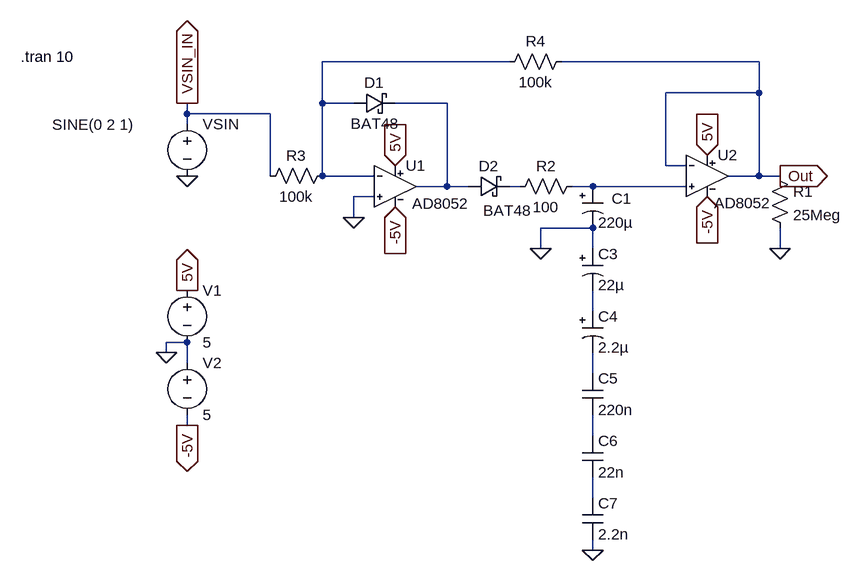
[diagram p0: schematic lf_wobbulator_tietze_schenks.asc]
lf_wobbulator_tietze_schenks.asc, the LTspice schematic file:
Version 4
SHEET 1 1728 920
WIRE 624 -32 336 -32
WIRE 1008 -32 704 -32
WIRE 1008 16 1008 -32
WIRE 1008 16 864 16
WIRE 336 32 336 -32
WIRE 384 32 336 32
WIRE 528 32 448 32
WIRE 128 48 128 32
WIRE 256 48 128 48
WIRE 128 64 128 48
WIRE 864 128 864 16
WIRE 896 128 864 128
WIRE 256 144 256 48
WIRE 336 144 336 32
WIRE 416 144 336 144
WIRE 1008 144 1008 16
WIRE 1008 144 960 144
WIRE 1040 144 1008 144
WIRE 528 160 528 32
WIRE 528 160 480 160
WIRE 560 160 528 160
WIRE 640 160 624 160
WIRE 752 160 720 160
WIRE 896 160 752 160
WIRE 416 176 384 176
WIRE 384 208 384 176
WIRE 752 224 672 224
WIRE 672 256 672 224
WIRE 752 256 752 224
WIRE 1040 256 1040 224
WIRE 752 352 752 320
WIRE 128 400 96 400
WIRE 96 416 96 400
WIRE 128 432 128 400
WIRE 752 448 752 416
WIRE 128 528 128 512
WIRE 752 544 752 512
WIRE 752 640 752 608
WIRE 752 720 752 704
FLAG 128 144 0
FLAG 128 32 VSIN_IN
IOPIN 128 32 Out
FLAG 448 128 5V
IOPIN 448 128 In
FLAG 1040 256 0
FLAG 448 192 -5V
IOPIN 448 192 In
FLAG 384 208 0
FLAG 128 320 5V
IOPIN 128 320 Out
FLAG 96 416 0
FLAG 1040 144 Out
IOPIN 1040 144 Out
FLAG 752 720 0
FLAG 672 256 0
FLAG 128 528 -5V
IOPIN 128 528 Out
FLAG 928 112 5V
IOPIN 928 112 In
FLAG 928 176 -5V
IOPIN 928 176 In
SYMBOL voltage 128 48 R0
WINDOW 123 -95 57 Left 2
WINDOW 39 0 0 Left 0
WINDOW 3 -208 17 Left 2
SYMATTR Value SINE(0 2 1)
SYMATTR InstName VSIN
SYMBOL res 1024 128 R0
SYMATTR InstName R1
SYMATTR Value 25Meg
SYMBOL res 352 128 R90
WINDOW 0 0 56 VBottom 2
WINDOW 3 32 56 VTop 2
SYMATTR InstName R3
SYMATTR Value 100k
SYMBOL voltage 128 304 R0
WINDOW 123 0 0 Left 0
WINDOW 39 0 0 Left 0
SYMATTR InstName V1
SYMATTR Value 5
SYMBOL voltage 128 416 R0
WINDOW 123 0 0 Left 0
WINDOW 39 0 0 Left 0
SYMATTR InstName V2
SYMATTR Value 5
SYMBOL OpAmps\\AD8052 448 160 R0
WINDOW 3 70 11 Top 2
SYMATTR InstName U1
SYMBOL polcap 736 160 R0
WINDOW 0 45 19 Left 2
SYMATTR InstName C1
SYMATTR Value 220µ
SYMATTR Description Capacitor
SYMATTR Type cap
SYMATTR SpiceLine V=10 Irms=17m Rser=1.9384 Lser=846.868p mfg="Würth Elektronik" pn="865250240001 WCAP-ASNP 4x5,5" type="Al electrolytic"
SYMBOL schottky 560 176 R270
WINDOW 0 32 32 VTop 2
WINDOW 3 -6 60 VBottom 2
SYMATTR InstName D2
SYMATTR Value BAT48
SYMATTR Description Diode
SYMATTR Type diode
SYMBOL polcap 736 256 R0
SYMATTR InstName C3
SYMATTR Value 22µ
SYMATTR Description Capacitor
SYMATTR Type cap
SYMATTR SpiceLine V=10 Irms=17m Rser=1.9384 Lser=846.868p mfg="Würth Elektronik" pn="865250240001 WCAP-ASNP 4x5,5" type="Al electrolytic"
SYMBOL polcap 736 352 R0
SYMATTR InstName C4
SYMATTR Value 2.2µ
SYMATTR Description Capacitor
SYMATTR Type cap
SYMATTR SpiceLine V=10 Irms=17m Rser=1.9384 Lser=846.868p mfg="Würth Elektronik" pn="865250240001 WCAP-ASNP 4x5,5" type="Al electrolytic"
SYMBOL cap 736 448 R0
SYMATTR InstName C5
SYMATTR Value 220n
SYMBOL cap 736 544 R0
SYMATTR InstName C6
SYMATTR Value 22n
SYMBOL cap 736 640 R0
SYMATTR InstName C7
SYMATTR Value 2.2n
SYMBOL schottky 384 48 R270
WINDOW 0 32 32 VTop 2
WINDOW 3 0 32 VBottom 2
SYMATTR InstName D1
SYMATTR Value BAT48
SYMATTR Description Diode
SYMATTR Type diode
SYMBOL OpAmps\\AD8052 928 144 R0
WINDOW 3 54 26 Top 2
SYMATTR InstName U2
SYMBOL res 736 144 R90
WINDOW 0 0 56 VBottom 2
WINDOW 3 32 56 VTop 2
SYMATTR InstName R2
SYMATTR Value 100
SYMBOL res 720 -48 R90
WINDOW 0 0 56 VBottom 2
WINDOW 3 32 56 VTop 2
SYMATTR InstName R4
SYMATTR Value 100k
TEXT -128 -40 Left 2 !.tran 10

The netlist it stands for:
* lf_wobbulator_tietze_schenks.asc
VSIN VSIN_IN 0 SINE(0 2 1)
R1 Out 0 25Meg
R3 N001 VSIN_IN 100k
V1 5V 0 5
V2 0 -5V 5
XU1 0 N001 5V -5V N002 AD8052  ; pins In+ In- V+ V- OUT
C1 N004 0 220µ V=10 Irms=17m Rser=1.9384 Lser=846.868p mfg="Würth Elektronik" pn="865250240001 WCAP-ASNP 4x5,5" type="Al electrolytic"
D2 N002 N003 BAT48
C3 0 N005 22µ V=10 Irms=17m Rser=1.9384 Lser=846.868p mfg="Würth Elektronik" pn="865250240001 WCAP-ASNP 4x5,5" type="Al electrolytic"
C4 N005 N006 2.2µ V=10 Irms=17m Rser=1.9384 Lser=846.868p mfg="Würth Elektronik" pn="865250240001 WCAP-ASNP 4x5,5" type="Al electrolytic"
C5 N006 N007 220n
C6 N007 N008 22n
C7 N008 0 2.2n
D1 N001 N002 BAT48
XU2 N004 Out 5V -5V Out AD8052  ; pins In+ In- V+ V- OUT
R2 N004 N003 100
R4 Out N001 100k
.model D D
.lib standard.dio
.tran 10
.lib AD8052.sub
.backanno
.end